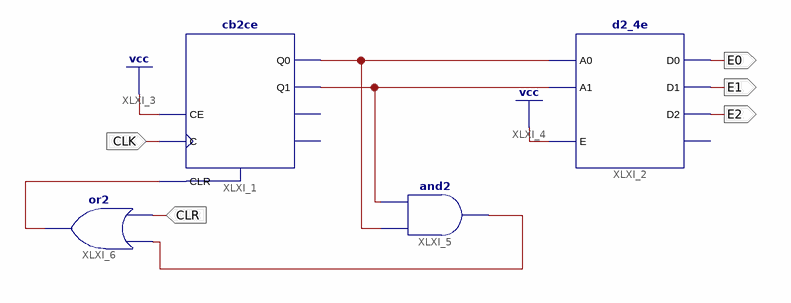
[diagram p0: schematic sheet 1]
// Xilinx ISE schematic turnCount.sch (spartan3) as structural Verilog: 4 symbols, 5 ports
module turnCount (
  input  CLK,
  input  CLR,
  output E0,
  output E1,
  output E2
);

  wire XLXN_9, XLXN_10, XLXN_11, XLXN_12;

  cb2ce XLXI_1 (.C(CLK), .CE(1'b1), .CLR(XLXN_12), .Q0(XLXN_10), .Q1(XLXN_9));  // open: CEO, TC
  d2_4e XLXI_2 (.A0(XLXN_10), .A1(XLXN_9), .E(1'b1), .D0(E0), .D1(E1), .D2(E2));  // open: D3
  and XLXI_5 (XLXN_11, XLXN_10, XLXN_9);
  or XLXI_6 (XLXN_12, XLXN_11, CLR);
endmodule
